# Altium schematic sheet main.SchDoc: AOU010
size A3; SheetNumber: 1; SheetTotal: 5
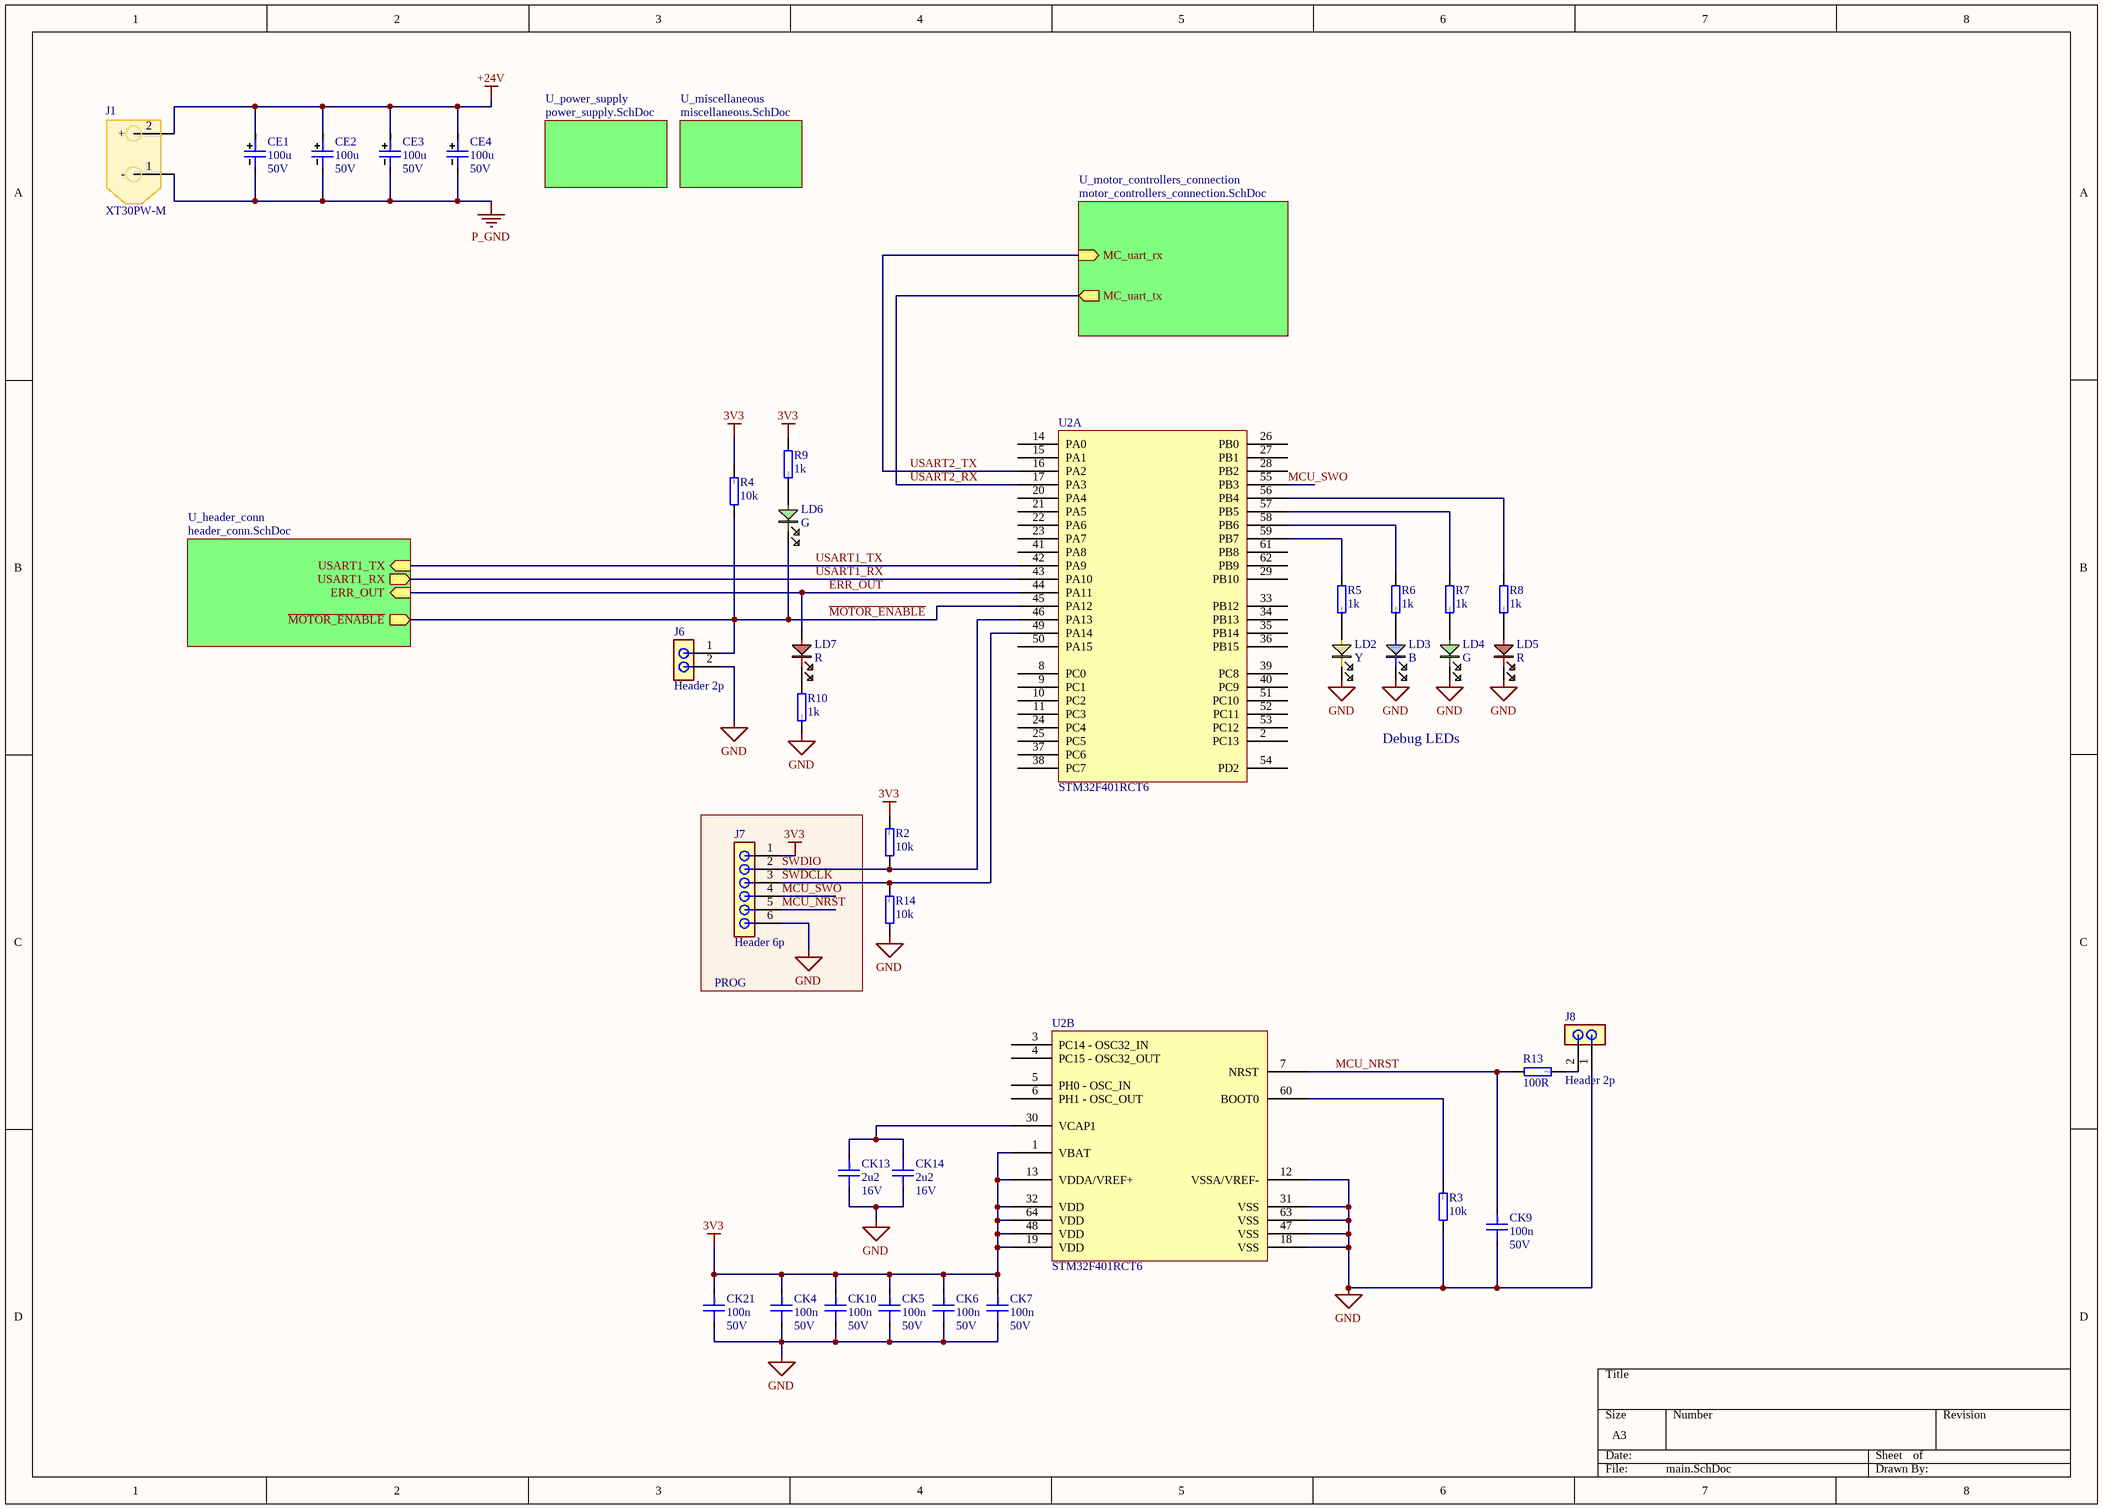
[diagram p0: main.SchDoc]

## Parts
CE1  100u  Voltage rating: 50V  [CAPAE830X1100N]
CE2  100u  Voltage rating: 50V  [CAPAE830X1100N]
CE3  100u  Voltage rating: 50V  [CAPAE830X1100N]
CE4  100u  Voltage rating: 50V  [CAPAE830X1100N]
CK4  100n  Voltage rating: 50V  [CAP0603]
CK5  100n  Voltage rating: 50V  [CAP0603]
CK6  100n  Voltage rating: 50V  [CAP0603]
CK7  100n  Voltage rating: 50V  [CAP0603]
CK9  100n  Voltage rating: 50V  [CAP0603]
CK10  100n  Voltage rating: 50V  [CAP0603]
CK13  2u2  Voltage rating: 16V  [CAP0603]
CK14  2u2  Voltage rating: 16V  [CAP0603]
CK21  100n  Voltage rating: 50V  [CAP0603]
J1  XT30PW-M  [XT30PWM]
J6  Header 2p  [Pin header 2p]
J7  Header 6p  [Pin header 6p]
J8  Header 2p  [Pin header 2p]
LD2  Y  [0603_LED_Y]
LD3  B  [0603_LED_B]
LD4  G  [0603_LED_G]
LD5  R  [0603_LED_R]
LD6  G  [0603_LED_G]
LD7  R  [0603_LED_R]
R2  10k  [RESC2012X06N(SMR0805)]
R3  10k  [RESC2012X06N(SMR0805)]
R4  10k  [RESC2012X06N(SMR0805)]
R5  1k  [RESC2012X06N(SMR0805)]
R6  1k  [RESC2012X06N(SMR0805)]
R7  1k  [RESC2012X06N(SMR0805)]
R8  1k  [RESC2012X06N(SMR0805)]
R9  1k  [RESC2012X06N(SMR0805)]
R10  1k  [RESC2012X06N(SMR0805)]
R13  100R  [RESC2012X06N(SMR0805)]
R14  10k  [RESC2012X06N(SMR0805)]
U2  STM32F401RCT6  [LQFP64]  (parts A,B of 2)

## Blocks framed on the sheet
PROG: J7

## Sub-sheets
U_header_conn = header_conn.SchDoc: ~{MOTOR_ENABLE} (out), ERR_OUT (in), USART1_RX (out), USART1_TX (in)
U_miscellaneous = miscellaneous.SchDoc: no entries
U_motor_controllers_connection = motor_controllers_connection.SchDoc: MC_uart_tx (out), MC_uart_rx (in)
U_power_supply = power_supply.SchDoc: no entries

## Nets
3V3: CK4.1 CK5.1 CK6.1 CK7.1 CK10.1 CK21.1 J7.1 R2.2 R4.2 R9.1 U2.1(VBAT) U2.13(VDDA/VREF+) U2.19(VDD) U2.32(VDD) U2.48(VDD) U2.64(VDD)
+24V: CE1.1 CE2.1 CE3.1 CE4.1 J1.2(+)
GND: CK4.2 CK5.2 CK6.2 CK7.2 CK9.2 CK10.2 CK13.2 CK14.1 CK21.2 J6.2 J7.6 J8.1 LD2.2 LD3.2 LD4.2 LD5.2 R3.1 R10.2 R14.1 U2.12(VSSA/VREF-) U2.18(VSS) U2.31(VSS) U2.47(VSS) U2.63(VSS)
P_GND: CE1.2 CE2.2 CE3.2 CE4.2 J1.1(-)
~{MOTOR_ENABLE}: J6.1 LD6.2 R4.1 U2.45(PA12) ; sheet U_header_conn/~{MOTOR_ENABLE}
ERR_OUT: LD7.1 U2.44(PA11) ; sheet U_header_conn/ERR_OUT
MCU_NRST: CK9.1 J7.5 R13.1 U2.7(NRST)
MCU_SWO: J7.4 U2.55(PB3)
SWDCLK: J7.3 R14.2 U2.49(PA14)
SWDIO: J7.2 R2.1 U2.46(PA13)
USART1_RX: U2.43(PA10) ; sheet U_header_conn/USART1_RX
USART1_TX: U2.42(PA9) ; sheet U_header_conn/USART1_TX
USART2_RX: U2.17(PA3) ; sheet U_motor_controllers_connection/MC_uart_tx
USART2_TX: U2.16(PA2) ; sheet U_motor_controllers_connection/MC_uart_rx
NetCK13_1: CK13.1 CK14.2 U2.30(VCAP1)
NetJ8_2: J8.2 R13.2
NetLD2_1: LD2.1 R5.2
NetLD3_1: LD3.1 R6.2
NetLD4_1: LD4.1 R7.2
NetLD5_1: LD5.1 R8.2
NetLD6_1: LD6.1 R9.2
NetLD7_2: LD7.2 R10.1
NetR3_2: R3.2 U2.60(BOOT0)
NetR5_1: R5.1 U2.59(PB7)
NetR6_1: R6.1 U2.58(PB6)
NetR7_1: R7.1 U2.57(PB5)
NetR8_1: R8.1 U2.56(PB4)

Not connected (* = marked no-connect by the designer): U2 2(PC13) 3(PC14_-_OSC32_IN) 4(PC15_-_OSC32_OUT) 5(PH0_-_OSC_IN) 6(PH1_-_OSC_OUT) 8(PC0) 9(PC1) 10(PC2) 11(PC3) 14(PA0) 15(PA1) 20(PA4) 21(PA5) 22(PA6) 23(PA7) 24(PC4) 25(PC5) 26(PB0) 27(PB1) 28(PB2) 29(PB10) 33(PB12) 34(PB13) 35(PB14) 36(PB15) 37(PC6) 38(PC7) 39(PC8) 40(PC9) 41(PA8) 50(PA15) 51(PC10) 52(PC11) 53(PC12) 54(PD2) 61(PB8) 62(PB9)

## Notes on the sheet
- Debug LEDs
- (in symbol Cap 2u2 0603) 0603
- (in symbol Cap 100n 0603) 0603
- (in symbol Cap el 100u 50V) D8xL10.2mm

## Library data of the parts
CE1-CE4 = Cap el 100u 50V: 100uF 50V ±20% SMD,D8xL10.2mm Aluminum Electrolytic Capacitors - SMD ROHS; Basic: No; Value: 100u; JLCPCB Part: C3352; TME Part: CK1H107M08010VR
CK4-CK7 CK9 CK10 CK21 = Cap 100n 0603: 50V 100nF X7R ±10% 0603 Multilayer Ceramic Capacitors MLCC - SMD/SMT ROHS; Basic: Yes; Value: 100n; JLCPCB Part: C14663
CK13 CK14 = Cap 2u2 0603: 16V 2.2uF X5R ±10% 0603 Multilayer Ceramic Capacitors MLCC - SMD/SMT ROHS; Basic: Yes; Value: 2u2; JLCPCB Part: C23630
J1 = XT30 male: plug; Current: 15A; Basic: No; ComponentLink1Description: New link; ComponentLink1URL: https://www.tme.eu/cz/details/xt30pw-m/konektory-dc/amass/; JLCPCB Part: C431092; TME Part: XT30PW-M
J6 J8 = Pin header 2p: Connector; Manufacturer_Name: Connfly; Manufacturer_Part_Number: DS1021-1*2SF11-B; Basic: No; Datasheet Link: https://www.tme.com/Document/cc301e58a5da78cb543a94b5a5b7f06a/DS1021.pdf; Height: 5.88mm; JLCPCB Part: C492401
J7 = Pin header 6p: 3A Direct Insert Policy 6P -40℃~+105℃ 2.54mm Single Row Black Brass 1x6P Plugin,P=2.54mm Pin Headers ROHS; Manufacturer_Name: Connfly; Manufacturer_Part_Number: DS1021-1*2SF11-B; Datasheet Link: https://www.tme.com/Document/cc301e58a5da78cb543a94b5a5b7f06a/DS1021.pdf; Height: 5.88mm; JLCPCB Part: C37208
LD2 = LED Y 0603: 0603 Yellow Led; JLCPCB Part: C7496811
LD3 = LED B 0603: 0603 Blue Led; JLCPCB Part: C7496819
LD4 LD6 = LED G 0603: 0603 Green Led; JLCPCB Part: C22371297
LD5 LD7 = LED R 0603: -40℃~+85℃ Red 0603 LED Indication - Discrete ROHS; JLCPCB Part: C2286
R2-R4 R14 = Res 10k 0805: 125mW Thick Film Resistors 150V ±100ppm/℃ ±1% 10kΩ 0805 Chip Resistor - Surface Mount ROHS; Tolerance & Rating: 1%/0.1W; Basic: Yes; Value: 10k; Package: 0805; SMD: 1; ComponentLink3Description: rezistor čip; ComponentLink3URL: heliosgreen://v1/hegMT/5-MT/Classes(343)/Folders/OpenForm?RecordNumbers=[381513]; JLCPCB Part: C17414
R5-R10 = Res 1k 0805: 125mW Thick Film Resistors 150V ±100ppm/℃ ±1% 1kΩ 0805 Chip Resistor - Surface Mount ROHS; Tolerance & Rating: 1%/0.1W; Basic: Yes; Value: 1k; Package: 0805; Author: JP/27.03.2014; SMD: 1; ComponentLink3Description: rezistor čip; ComponentLink3URL: heliosgreen://v1/hegMT/5-MT/Classes(343)/Folders/OpenForm?RecordNumbers=[381513]; JLCPCB Part: C17513
R13 = Res 100R 0805: 125mW Thick Film Resistors 150V ±100ppm/℃ ±1% 100Ω 0805 Chip Resistor - Surface Mount ROHS; Tolerance & Rating: 1%/0.1W; Basic: Yes; Value: 100R; Package: 0805; Author: JP/27.03.2014; SMD: 1; ComponentLink3Description: rezistor čip; ComponentLink3URL: heliosgreen://v1/hegMT/5-MT/Classes(343)/Folders/OpenForm?RecordNumbers=[381513]; JLCPCB Part: C17408
U2 = STM32F401RCT6: 256KB 1.7V~3.6V ARM-M4 64KB 84MHz FLASH 50 LQFP-64(10x10) Microcontrollers (MCU/MPU/SOC) ROHS; Basic: No; JLCPCB Part: C74524